# Altium schematic sheet output_stage.SchDoc: AI ARTIQ Driver
size 420 x 297 mm; Author: G.Kasprowicz; CompanyName: CTI; Organization: CTI; Address1: CTI; Address2: Nowowiejska 15/19 00-665 Warsaw; Address3: gkasprow@gmail.com; DocumentNumber: 2; Revision: 1.0; SheetNumber: 2; SheetTotal: 11; ModifiedBy: -; CheckedDate: -; Title2: output stage; DivGrp: CTI; ModifiedDate: -; ProjectName: Sensor Box
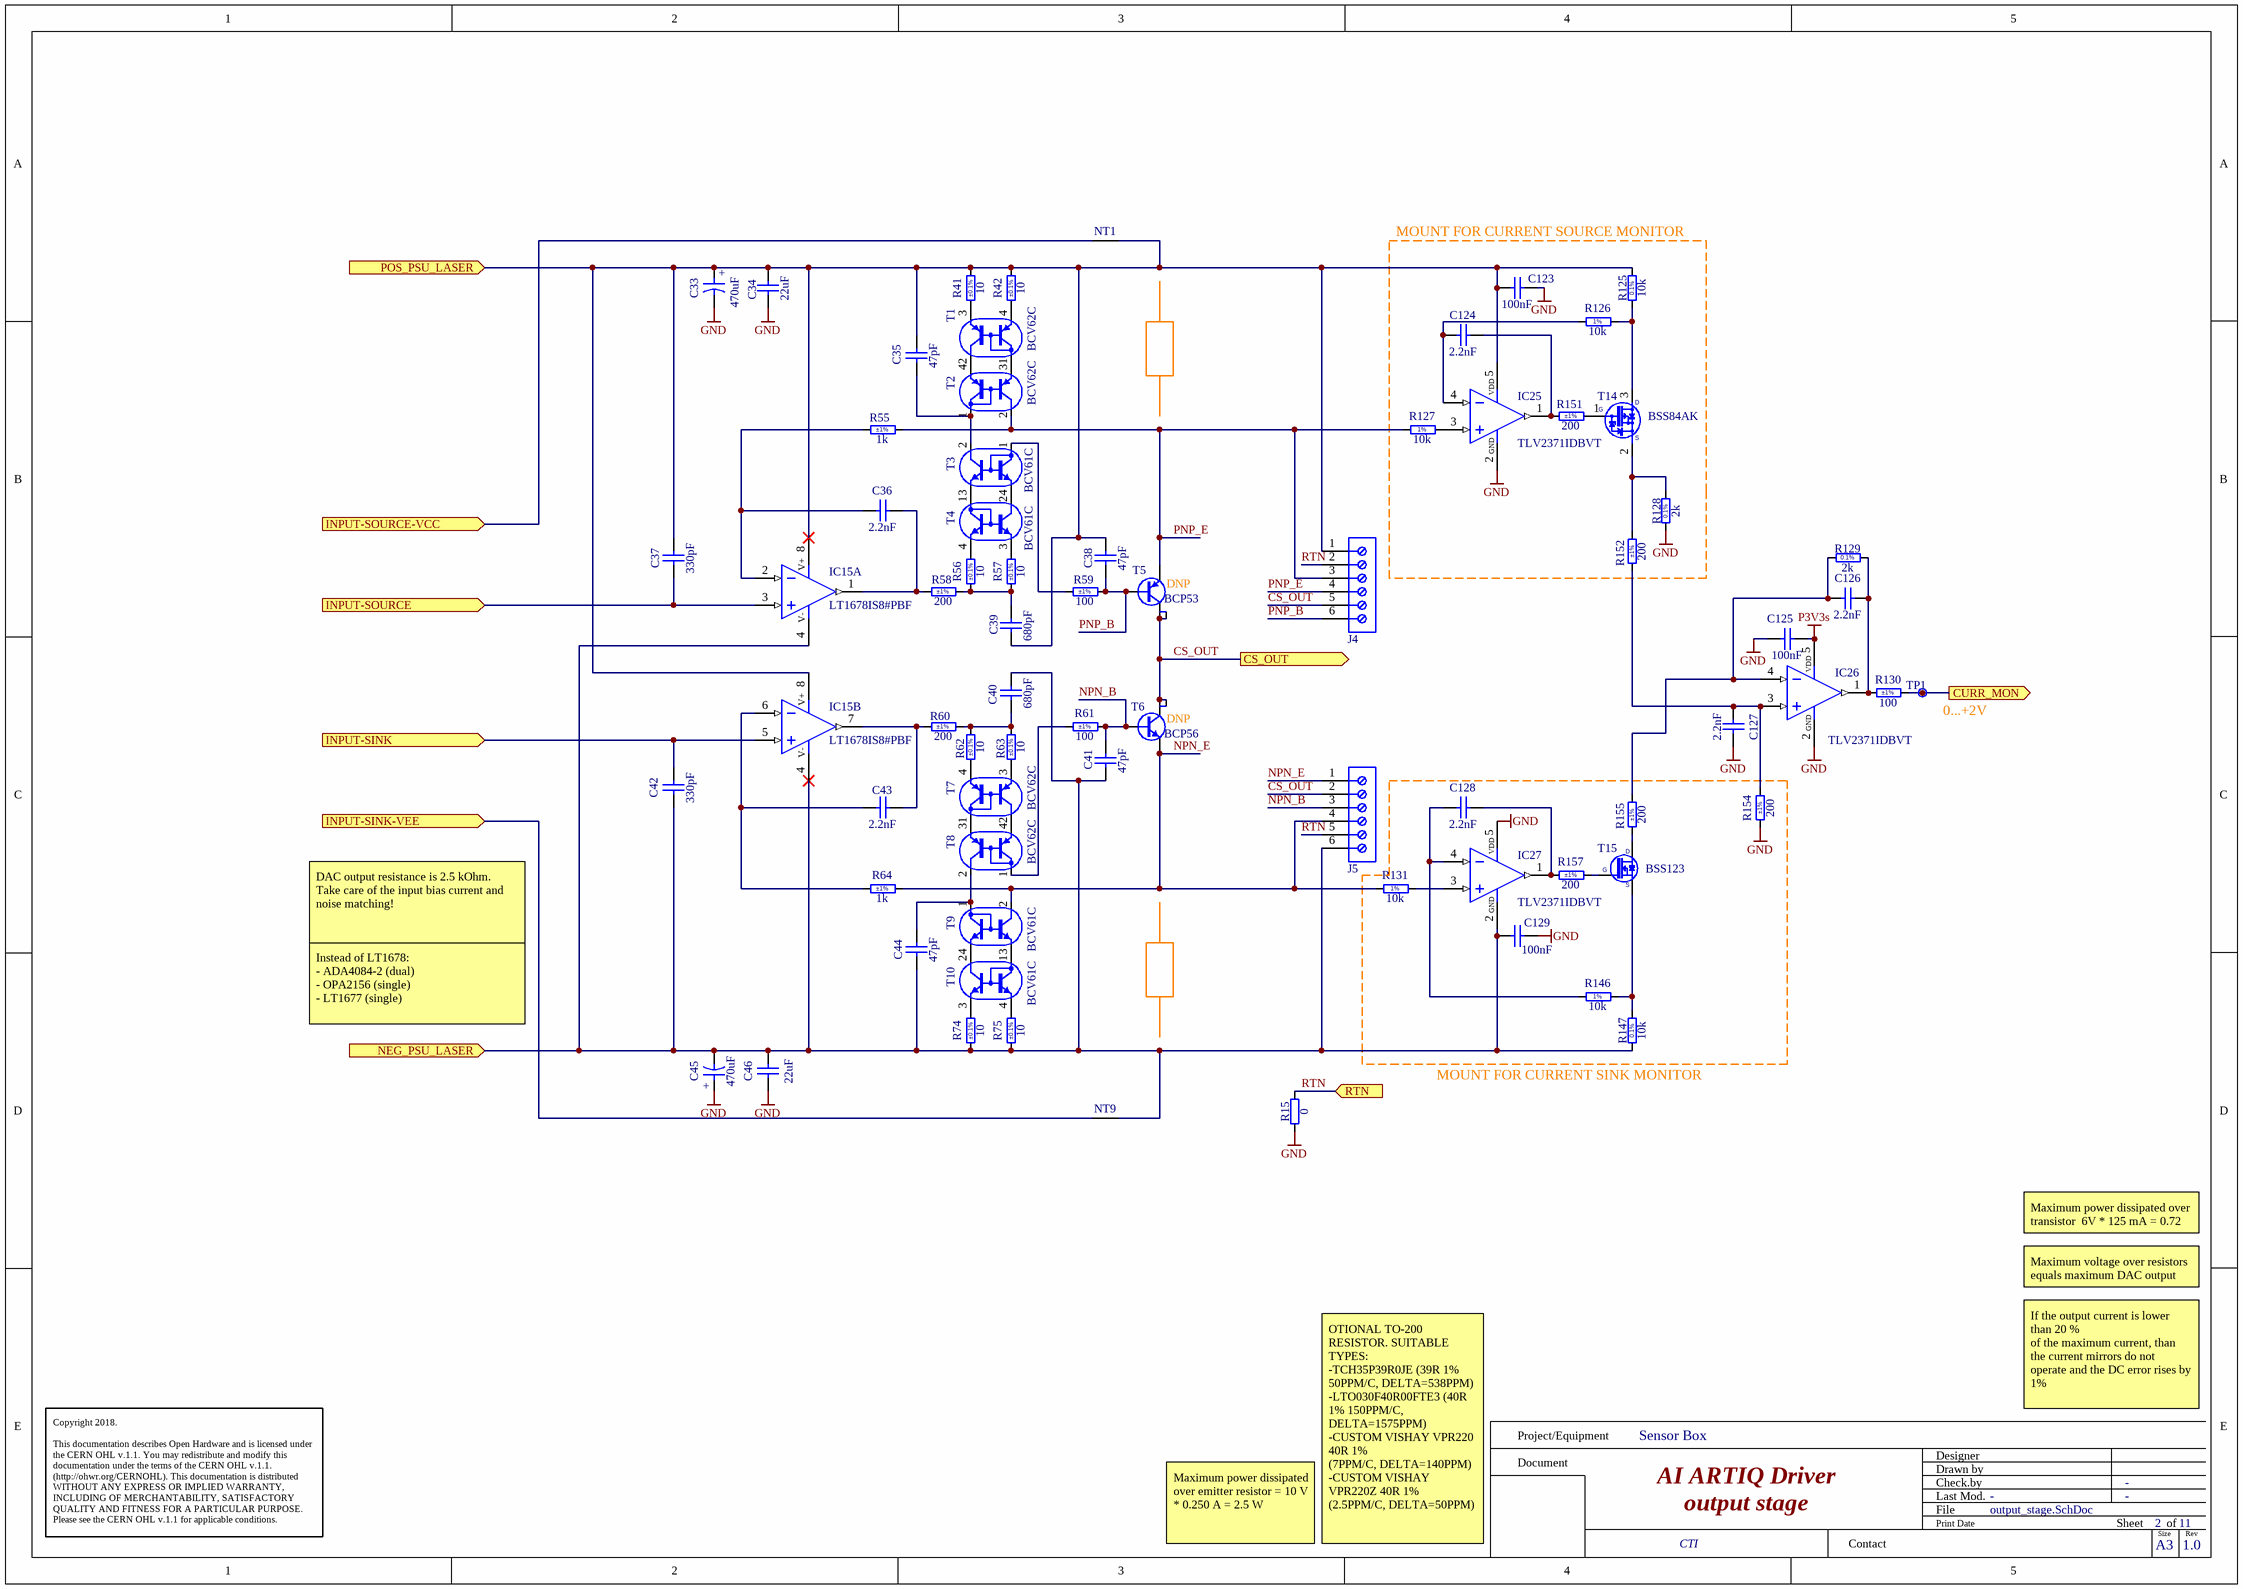
[diagram p0: output_stage.SchDoc]

## Parts
C33  470uF  [CAPAE1030X1020N]
C34  22uF  [CAPC3225X140N]
C35  47pF  [CAPC1608X87N]
C36  2.2nF  [CAPC1608X87N]
C37  330pF  [CAPC1608X90N]
C38  47pF  [CAPC1608X87N]
C39  680pF  [CAPC1608X87N]
C40  680pF  [CAPC1608X87N]
C41  47pF  [CAPC1608X87N]
C42  330pF  [CAPC1608X90N]
C43  2.2nF  [CAPC1608X87N]
C44  47pF  [CAPC1608X87N]
C45  470uF  [CAPAE1030X1020N]
C46  22uF  [CAPC3225X140N]
C123  100nF  [CAPC1608X87N]
C124  2.2nF  [CAPC1608X87N]
C125  100nF  [CAPC1608X87N]
C126  2.2nF  [CAPC1608X87N]
C127  2.2nF  [CAPC1608X87N]
C128  2.2nF  [CAPC1608X87N]
C129  100nF  [CAPC1608X87N]
IC15  LT1678IS8#PBF  [SOIC127P600X175-8N]  (parts A,B of 2)
IC25  TLV2371IDBVT  [SOT95P280X145-5N]
IC26  TLV2371IDBVT  [SOT95P280X145-5N]
IC27  TLV2371IDBVT  [SOT95P280X145-5N]
J4  691210910006  [691210910006]  (value not drawn)
J5  691210910006  [691210910006]  (value not drawn)
NT1  Net Tie  [Net Tie]  (value not drawn)  (net tie, no BOM)
NT9  Net Tie  [Net Tie]  (value not drawn)  (net tie, no BOM)
R15  0  [RESC2012X60N]
R41  10  Tolerance: ±0.1%  [RESC1608X55N]
R42  10  Tolerance: ±0.1%  [RESC1608X55N]
R55  1k  Tolerance: ±1%  [RESC1608X55N]
R56  10  Tolerance: ±0.1%  [RESC1608X55N]
R57  10  Tolerance: ±0.1%  [RESC1608X55N]
R58  200  Tolerance: ±1%  [RESC1608X55N]
R59  100  Tolerance: ±1%  [RESC1608X55N]
R60  200  Tolerance: ±1%  [RESC1608X55N]
R61  100  Tolerance: ±1%  [RESC1608X55N]
R62  10  Tolerance: ±0.1%  [RESC1608X55N]
R63  10  Tolerance: ±0.1%  [RESC1608X55N]
R64  1k  Tolerance: ±1%  [RESC1608X55N]
R74  10  Tolerance: ±0.1%  [RESC1608X55N]
R75  10  Tolerance: ±0.1%  [RESC1608X55N]
R125  10k  [RESC1608X64N]
R126  10k  [RESC1608X55N]
R127  10k  [RESC1608X55N]
R128  2k  [RESC1608X55N]
R129  2k  [RESC1608X55N]
R130  100  Tolerance: ±1%  [RESC1608X55N]
R131  10k  [RESC1608X55N]
R146  10k  [RESC1608X55N]
R147  10k  [RESC1608X64N]
R151  200  Tolerance: ±1%  [RESC1608X55N]
R152  200  Tolerance: ±1%  [RESC1608X55N]
R154  200  Tolerance: ±1%  [RESC1608X55N]
R155  200  Tolerance: ±1%  [RESC1608X55N]
R157  200  Tolerance: ±1%  [RESC1608X55N]
T1  BCV62C  [SOT143N]
T2  BCV62C  [SOT143N]
T3  BCV61C  [SOT143N]
T4  BCV61C  [SOT143N]
T5  BCP53  [SOT230P700X180-4N]
T6  BCP56  [SOT230P700X180-4N]
T7  BCV62C  [SOT143N]
T8  BCV62C  [SOT143N]
T9  BCV61C  [SOT143N]
T10  BCV61C  [SOT143N]
T14  BSS84AK  [SOT95P230X110-3N]
T15  BSS123  [SOT95P240X130-3N]
TP1  Test Point  [TPS127]  (value not drawn)  (no BOM)

## Blocks framed on the sheet
MOUNT FOR CURRENT SOURCE MONITOR: C123 C124 IC25 R125-R128 R151 R152 T14

## Ports
CS_OUT (out), CURR_MON (out), INPUT-SINK (in), INPUT-SINK-VEE (in), INPUT-SOURCE (in), INPUT-SOURCE-VCC (in), NEG_PSU_LASER (in), POS_PSU_LASER (in), RTN (in)

## Nets
GND: C33.2 C34.1 C45.1 C46.2 C123.2 C125.1 C127.2 C129.1 IC25.2(V-) IC26.2(V-) IC27.5(V+) R15.1 R128.1 R154.1
P3V3s: C125.2 IC26.5(V+)
CS_OUT: J4.5 J5.2 T5.2(C) T5.4(C) T6.2(C) T6.4(C) ; port CS_OUT
CURR_MON: R130.2 TP1.1 ; port CURR_MON
INPUT-SINK: C42.2 IC15.5(IN+) ; port INPUT-SINK
INPUT-SINK-VEE: NT9.1 ; port INPUT-SINK-VEE
INPUT-SOURCE: C37.1 IC15.3(IN+) ; port INPUT-SOURCE
INPUT-SOURCE-VCC: NT1.1 ; port INPUT-SOURCE-VCC
NEG_PSU_LASER: C40.2 C41.1 C42.1 C44.1 C45.2 C46.1 C129.2 IC15.4(V-) IC27.2(V-) J5.6 NT9.2 R74.1 R75.1 R147.1 ; port NEG_PSU_LASER
NPN_B: C41.2 J5.3 R61.2 T6.1(B)
NPN_E: J5.1 J5.4 R64.2 R131.1 T6.3(E) T9.2(C)
PNP_B: C38.1 J4.6 R59.2 T5.1(B)
PNP_E: J4.3 J4.4 R55.2 R127.1 T2.2(C) T5.3(E)
POS_PSU_LASER: C33.1 C34.2 C35.2 C37.2 C38.2 C39.1 C123.1 IC15.8(V+) IC25.5(V+) J4.1 NT1.2 R41.2 R42.2 R125.2 ; port POS_PSU_LASER
RTN: J4.2 J5.5 R15.2 ; port RTN
NetC35_1: C35.1 T2.1(C) T3.2(C)
NetC36_1: C36.1 IC15.2(IN-) R55.1
NetC36_2: C36.2 IC15.1(OUT) R58.1
NetC39_2: C39.2 R56.1 R57.1 R58.2
NetC40_1: C40.1 R60.2 R62.2 R63.2
NetC43_1: C43.1 IC15.6(IN-) R64.1
NetC43_2: C43.2 IC15.7(OUT) R60.1
NetC44_2: C44.2 T8.2(C) T9.1(C)
NetC124_1: C124.1 IC25.4(IN-) R126.1
NetC124_2: C124.2 IC25.1(OUT) R151.1
NetC126_1: C126.1 IC26.4(IN-) R129.1 R155.2
NetC126_2: C126.2 IC26.1(OUT) R129.2 R130.1
NetC127_1: C127.1 IC26.3(IN+) R152.1 R154.2
NetC128_1: C128.1 IC27.4(IN-) R146.1
NetC128_2: C128.2 IC27.1(OUT) R157.1
NetIC25_3: IC25.3(IN+) R127.2
NetIC27_3: IC27.3(IN+) R131.2
NetR41_1: R41.1 T1.3(E)
NetR42_1: R42.1 T1.4(E)
NetR56_2: R56.2 T4.4(E)
NetR57_2: R57.2 T4.3(E)
NetR59_1: R59.1 T3.1(C)
NetR61_1: R61.1 T8.1(C)
NetR62_1: R62.1 T7.4(E)
NetR63_1: R63.1 T7.3(E)
NetR74_2: R74.2 T10.3(E)
NetR75_2: R75.2 T10.4(E)
NetR125_1: R125.1 R126.2 T14.3(D)
NetR128_2: R128.2 R152.2 T14.2(S)
NetR146_2: R146.2 R147.2 T15.2(S)
NetR151_2: R151.2 T14.1(G)
NetR155_1: R155.1 T15.3(D)
NetR157_2: R157.2 T15.1(G)
NetT1_1: T1.1(C) T2.3(E)
NetT1_2: T1.2(C) T2.4(E)
NetT3_3: T3.3(E) T4.1(C)
NetT3_4: T3.4(E) T4.2(C)
NetT7_1: T7.1(C) T8.3(E)
NetT7_2: T7.2(C) T8.4(E)
NetT9_3: T9.3(E) T10.1(C)
NetT9_4: T9.4(E) T10.2(C)

## Notes on the sheet
- (near T5) DNP
- (near T6) DNP
- (near TP1) 0...+2V
- DAC output resistance is 2.5 kOhm.
  Take care of the input bias current and noise matching!
- Instead of LT1678:
  - ADA4084-2 (dual)
  - OPA2156 (single)
  - LT1677 (single)
- (near R147) MOUNT FOR CURRENT SINK MONITOR
- Maximum power dissipated over transistor  6V * 125 mA = 0.72 W
- Maximum voltage over resistors equals maximum DAC output voltage = 10 V
- If the output current is lower than 20 %
  of the maximum current, than the current mirrors do not operate and the DC error rises by  1%
- Maximum power dissipated over emitter resistor = 10 V * 0.250 A = 2.5 W
- OTIONAL TO-200 RESISTOR. SUITABLE TYPES:
  -TCH35P39R0JE (39R 1% 50PPM/C, DELTA=538PPM)
  -LTO030F40R00FTE3 (40R 1% 150PPM/C, DELTA=1575PPM)
  -CUSTOM VISHAY VPR220 40R 1%
  (7PPM/C, DELTA=140PPM)
  -CUSTOM VISHAY VPR220Z 40R 1%
  (2.5PPM/C, DELTA=50PPM)
- Project/Equipment
- Document
- Designer
- Drawn by
- Check.by
- Copyright 2018.
  This documentation describes Open Hardware and is licensed under the CERN OHL v.1.1. You may redistribute and modify this documentation under the terms of the CERN OHL v.1.1. (http://ohwr.org/CERNOHL). This documentation is distributed WITHOUT ANY EXPRESS OR IMPLIED WARRANTY, INCLUDING OF MERCHANTABILITY, SATISFACTORY QUALITY AND FITNESS FOR A PARTICULAR PURPOSE. Please see the CERN OHL v.1.1 for applicable conditions.
- Contact
- File
- Last Mod.
- Print Date
- Sheet
- Size
- A3
- of
- Rev
- (in symbol CAE1030-1020_470UF_25V_20%) +
- (in symbol R0603_2K_0.1%_0.063W_10PPM) 0.1%
- (in symbol R0603_10K_0.1%_0.1W_25PPM) 0.1%
- (in symbol R0603_10K_1%_0.1W_100PPM) 1%
- (in symbol TLV2371IDBVT) VDD; GND

## Library data of the parts
C33 C45 = CAE1030-1020_470UF_25V_20%: Polarised capacitor; Part Description: Aluminum Electrolytic SMT Capacitor; Manufacturer: PANASONIC; Manufacturer Part Number: EEEFK1E471AP; Voltage: 25V; Tolerance: ±20%; Part Number: CAE1030-1020_470UF_25V_20%; Component Kind: Standard; Component Type: Standard; Pin Count: 2; Value: 470uF; Status: Not Recommended; Case: G; Mounted: Yes; Socket: No; SMD: Yes; Sense: No; ComponentHeight: 10.2mm; HelpURL: \\cern.ch\dfs\Applications\Altium\Datasheets\CAE_PANASONIC_FK-V.pdf; Author: CERN DEM JLC; CreateDate: 03.12.2007; LatestRevisionDate: 05.11.2014
C34 C46 = CC1210_22UF_25V_20%_X7R: Non-polarised capacitor; Part Description: SMD Multilayer Chip Ceramic Capacitor; Manufacturer: GENERIC; Manufacturer1 Part Number: C1210C226M3RACTU; Voltage: 25V; TC: X7R; Tolerance: ±20%; Part Number: CC1210_22UF_25V_20%_X7R; Component Kind: Standard; Component Type: Standard; Pin Count: 2; Value: 22uF; Status: None; Manufacturer Part Number: CC1210_22UF_25V_20%_X7R; Case: 1210; Mounted: Yes; Socket: No; SMD: Yes; Sense: No; Manufacturer1 Example: KEMET; Manufacturer1 ComponentHeight: 1.4mm; HelpURL: \\cern.ch\dfs\Applications\Altium\Datasheets\CC1210_X7R_KEMET.pdf; Author: CERN DEM JLC; CreateDate: 20.02.2018; LatestRevisionDate: 20.02.2018
C35 C38 C41 C44 = CC0603_47PF_50V_5%_NP0: Non-polarised capacitor; Part Description: SMD Multilayer Chip Ceramic Capacitor; Manufacturer: GENERIC; Manufacturer1 Part Number: 223886715479; Voltage: 50V; TC: C0G/NP0; Tolerance: ±5%; Part Number: CC0603_47PF_50V_5%_NP0; Component Kind: Standard; Component Type: Standard; Pin Count: 2; Value: 47pF; Status: Preferred; Manufacturer Part Number: CC0603_47PF_50V_5%_NP0; Case: 0603; Mounted: Yes; Socket: No; SMD: Yes; Sense: No; Manufacturer1 Example: PHYCOMP; Manufacturer1 ComponentHeight: 0.87mm; HelpURL: \\cern.ch\dfs\Applications\Altium\Datasheets\CC0603_NP0_PHYCOMP.pdf; Author: CERN DEM JLC; CreateDate: 03.12.2007; LatestRevisionDate: 03.12.2007
C36 C43 C124 C126-C128 = CC0603_2.2NF_50V_5%_C0G: Non-polarised capacitor; Part Description: SMD Multilayer Chip Ceramic Capacitor; Manufacturer: GENERIC; Manufacturer1 Part Number: C1608C0G1H222J080AA; Voltage: 50V; TC: C0G/NP0; Tolerance: ±5%; Part Number: CC0603_2.2NF_50V_5%_C0G; Component Kind: Standard; Component Type: Standard; Pin Count: 2; Value: 2.2nF; Status: Preferred; Manufacturer Part Number: CC0603_2.2NF_50V_5%_C0G; Case: 0603; Mounted: Yes; Socket: No; SMD: Yes; Sense: No; Manufacturer1 Example: TDK; Manufacturer1 ComponentHeight: 0.9mm; HelpURL: \\cern.ch\dfs\Applications\Altium\Datasheets\CC0603_C0G_TDK_C.pdf; Author: CERN DEM JMW; CreateDate: 23.06.2014; LatestRevisionDate: 23.06.2014
C37 C42 = CC0603_330PF_50V_5%_C0G_MURATA_GCM1885C1H331JA16D: Non-polarised capacitor; Part Description: Chip Monolithic Ceramic Capacitor for Automotive; Manufacturer: MURATA; Voltage: 50V; TC: C0G/NP0; Tolerance: ±5%; Part Number: CC0603_330PF_50V_5%_C0G_MURATA_GCM1885C1H331JA16D; Component Kind: Standard; Component Type: Standard; Pin Count: 2; Value: 330pF; Status: Not Recommended; Manufacturer Part Number: GCM1885C1H331JA16D; Case: 0603; Mounted: Yes; Socket: No; SMD: Yes; Sense: No; ComponentHeight: 0.9mm; HelpURL: \\cern.ch\dfs\Applications\Altium\Datasheets\CC0603_MURATA_GCM1885C1H331JA16D.pdf; Author: CERN DEM JLC; CreateDate: 10.05.2017; LatestRevisionDate: 10.05.2017
C39 C40 = CC0603_680PF_50V_5%_NP0: Non-polarised capacitor; Part Description: SMD Multilayer Chip Ceramic Capacitor; Manufacturer: GENERIC; Manufacturer1 Part Number: 223886715681; Voltage: 50V; TC: C0G/NP0; Tolerance: ±5%; Part Number: CC0603_680PF_50V_5%_NP0; Component Kind: Standard; Component Type: Standard; Pin Count: 2; Value: 680pF; Status: Preferred; Manufacturer Part Number: CC0603_680PF_50V_5%_NP0; Case: 0603; Mounted: Yes; Socket: No; SMD: Yes; Sense: No; Manufacturer1 Example: PHYCOMP; Manufacturer1 ComponentHeight: 0.87mm; HelpURL: \\cern.ch\dfs\Applications\Altium\Datasheets\CC0603_NP0_PHYCOMP.pdf; Author: CERN DEM JLC; CreateDate: 03.12.2007; LatestRevisionDate: 03.12.2007
C123 C125 C129 = CC0603_100NF_50V_10%_X7R: Non-polarised capacitor; Part Description: SMD Multilayer Chip Ceramic Capacitor; Manufacturer: GENERIC; Manufacturer1 Part Number: 223858615649; Voltage: 50V; TC: X7R; Tolerance: ±10%; Part Number: CC0603_100NF_50V_10%_X7R; Component Kind: Standard; Component Type: Standard; Pin Count: 2; Value: 100nF; Status: Preferred; Manufacturer Part Number: CC0603_100NF_50V_10%_X7R; Case: 0603; Mounted: Yes; Socket: No; SMD: Yes; Sense: No; Manufacturer1 Example: PHYCOMP; Manufacturer1 ComponentHeight: 0.87mm; HelpURL: \\cern.ch\dfs\Applications\Altium\Datasheets\CC0603_X7R_PHYCOMP.pdf; Author: CERN DEM JLC; CreateDate: 03.12.2007; LatestRevisionDate: 03.12.2007
IC15 = LT1678IS8#PBF: Dual Operational Amplifier; Part Description: Dual Low Noise, Rail-to-Rail, Precision Operational Amplifier; Manufacturer: LINEAR TECHNOLOGY; PressFit: No; Bonding: No; Part Number: LT1678IS8#PBF; Component Kind: Standard; Component Type: Standard; Device: LT1678IS8#PBF; PackageDescription: SOIC 8, Pitch 1.27mm - Body 4x5mm, IPC Medium Density; Manufacturer Part Number: LT1678IS8#PBF; Pin Count: 8; Case: SOIC8; Mounted: Yes; Socket: No; SMD: Yes; Sense: No; ComponentHeight: 1.75mm; Author: CERN DEM JLC; HelpURL: \\cern.ch\dfs\Applications\Altium\Datasheets\LT1678IS8#PBF.pdf; CreateDate: 09.07.2014; LatestRevisionDate: 09.07.2014
IC25-IC27 = TLV2371IDBVT: 500uA, 3MHz Rail-to-Rail Input/Output Operational Amplifier With Shutdown; Manufacturer: TEXAS INSTRUMENTS; PressFit: No; Bonding: No; Part Number: TLV2371IDBVT; Component Kind: Standard; Component Type: Standard; Device: TLV2371IDBVT; PackageDescription: SOT, 0.95mm pitch; 5 Pin, 1.60mm W X 2.90mm L X 1.45mm H body, IPC Medium Density; Part Description: 500uA, 3MHz Rail-to-Rail Input/Output Operational Amplifier With Shutdown; Manufacturer Part Number: TLV2371IDBVT; Pin Count: 5; Case: SOT23-5; Mounted: Yes; Socket: No; SMD: Yes; Sense: No; ComponentHeight: 1.45mm; Author: CERN DEM JLC; HelpURL: \\cern.ch\dfs\Applications\Altium\Datasheets\TLV2371IDBVT.pdf; CreateDate: 03.07.2014; LatestRevisionDate: 03.07.2014
J4 J5 = 691210910006: WR-TBL Series 2109 Horizontal Entry, Through Hole, pitch 2.54mm, 6p; Manufacturer: Wurth Elektronik; Pin Number: 6; Rated Current: 6A; Working Voltage: 150V; PCB/Cable/Panel: PCB; Modularity: No; ComponentLink1Description: Manufacturer Link; ComponentLink1URL: https://www.we-online.com/redexpert/article/691210910006?ad; ComponentLink2Description: Datasheet; ComponentLink2URL: https://www.we-online.com/redexpert/spec/691210910006?ad; Category: Terminal Blocks; Match Code: WR-TBL; Manufacturer Part Number: 691210910006; Mount: Through Hole; Operating Temperature Max: 105°C; Operating Temperature Min: -40°C; Packaging: Box; Pitch: 2.54mm; Orientation: Horizontal; Application: Rising Cage Clamp
NT1 NT9 = Net Tie: Part Description: Net Tie (2 Nets); Mounted: No; Part Number: Net Tie; Component Type: Net Tie; Pin Count: 2; Family: Net Tie; Socket: No; SMD: No; Sense: No; Status: None; ComponentHeight: 0mm; HelpURL: Undefined; Author: CERN DEM JLC; CreateDate: 22.03.2011; LatestRevisionDate: 22.03.2011; PackageDescription: 2 Plated Through Hole For Coaxial Cable Link: Hole Dia.=1.4mm Pad Dia.=2.5mm
R15 = R0805_0R_JUMPER: Resistor; Part Description: 2A (0.05R Max DC Resistance) Zero Ohm Jumper; Manufacturer: GENERIC; Manufacturer1 Part Number: NRC10Z0; PressFit: No; Part Number: R0805_0R_JUMPER; Component Kind: Standard; Component Type: Standard; Pin Count: 2; Value: 0; Status: Preferred; Manufacturer Part Number: R0805_0R_JUMPER; Case: 0805; Mounted: Yes; Sense: No; Socket: No; SMD: Yes; Manufacturer1 Example: NIC COMPONENT; Manufacturer1 ComponentHeight: 0.6mm; HelpURL: \\cern.ch\dfs\Applications\Altium\Datasheets\R0805_NIC_NRC.pdf; Author: CERN DEM JLC; CreateDate: 03.12.2007; LatestRevisionDate: 13.03.2008
R41 R42 R56 R57 R62 R63 R74 R75 = R0603_10R_0.1%_0.063W_25PPM: Resistor - 0.1%; Part Description: Thin Film Chip Resistor; Manufacturer: GENERIC; Manufacturer1 Part Number: CPF0603B10RE1; Power: 0.063W; TC: ±25ppm; PressFit: No; Part Number: R0603_10R_0.1%_0.063W_25PPM; Component Kind: Standard; Component Type: Standard; Pin Count: 2; Value: 10; Status: Not Recommended; Manufacturer Part Number: R0603_10R_0.1%_0.063W_25PPM; Case: 0603; Mounted: Yes; Sense: No; Socket: No; SMD: Yes; Manufacturer1 Example: TE CONNECTIVITY; Manufacturer1 ComponentHeight: 0.55mm; HelpURL: \\cern.ch\dfs\Applications\Altium\Datasheets\R0603_TYCO_CPF.pdf; Author: CERN DEM JLC; CreateDate: 12.01.2017; LatestRevisionDate: 12.01.2017
R55 R64 = R0603_1K_1%_0.1W_100PPM: Resistor - 1%; Part Description: General Purpose Thick Film Chip Resistor; Manufacturer: GENERIC; Manufacturer1 Part Number: NRC06F1001TRF; Power: 0.1W; TC: ±100ppm/°C; PressFit: No; Part Number: R0603_1K_1%_0.1W_100PPM; Component Kind: Standard; Component Type: Standard; Pin Count: 2; Value: 1k; Status: Preferred; Manufacturer Part Number: R0603_1K_1%_0.1W_100PPM; Case: 0603; Mounted: Yes; Sense: No; Socket: No; SMD: Yes; Manufacturer1 Example: NIC COMPONENT; Manufacturer1 ComponentHeight: 0.55mm; HelpURL: \\cern.ch\dfs\Applications\Altium\Datasheets\R0603_NIC_NRC.pdf; Author: CERN DEM JLC; CreateDate: 03.12.2007; LatestRevisionDate: 13.03.2008
R58 R60 R151 R152 R154 R155 R157 = R0603_200R_1%_0.1W_100PPM: Resistor - 1%; Part Description: General Purpose Thick Film Chip Resistor; Manufacturer: GENERIC; Manufacturer1 Part Number: NRC06F2000TRF; Power: 0.1W; TC: ±100ppm/°C; PressFit: No; Part Number: R0603_200R_1%_0.1W_100PPM; Component Kind: Standard; Component Type: Standard; Pin Count: 2; Value: 200; Status: Preferred; Manufacturer Part Number: R0603_200R_1%_0.1W_100PPM; Case: 0603; Mounted: Yes; Sense: No; Socket: No; SMD: Yes; Manufacturer1 Example: NIC COMPONENT; Manufacturer1 ComponentHeight: 0.55mm; HelpURL: \\cern.ch\dfs\Applications\Altium\Datasheets\R0603_NIC_NRC.pdf; Author: CERN DEM JLC; CreateDate: 03.12.2007; LatestRevisionDate: 13.03.2008
R59 R61 R130 = R0603_100R_1%_0.1W_100PPM: Resistor - 1%; Part Description: General Purpose Thick Film Chip Resistor; Manufacturer: GENERIC; Manufacturer1 Part Number: NRC06F4700TRF; Power: 0.1W; TC: ±100ppm/°C; PressFit: No; Part Number: R0603_100R_1%_0.1W_100PPM; Component Kind: Standard; Component Type: Standard; Pin Count: 2; Value: 100; Status: Preferred; Manufacturer Part Number: R0603_100R_1%_0.1W_100PPM; Case: 0603; Mounted: Yes; Sense: No; Socket: No; SMD: Yes; Manufacturer1 Example: NIC COMPONENT; Manufacturer1 ComponentHeight: 0.55mm; HelpURL: \\cern.ch\dfs\Applications\Altium\Datasheets\R0603_NIC_NRC.pdf; Author: CERN DEM JLC; CreateDate: 03.12.2007; LatestRevisionDate: 13.03.2008
R125 R147 = R0603_10K_0.1%_0.1W_25PPM: Resistor - 0.1%; Part Description: Thin Film Chip Resistor; Manufacturer: GENERIC; Manufacturer1 Part Number: ERA3AEB103V; Power: 0.1W; TC: ±25ppm/°C; PressFit: No; Part Number: R0603_10K_0.1%_0.1W_25PPM; Component Kind: Standard; Component Type: Standard; Pin Count: 2; Value: 10k; Status: Not Recommended; Tolerance: ±0.1%; Manufacturer Part Number: R0603_10K_0.1%_0.1W_25PPM; Case: 0603; Mounted: Yes; Sense: No; Socket: No; SMD: Yes; Manufacturer1 Example: PANASONIC; Manufacturer1 ComponentHeight: 0.55mm; HelpURL: \\cern.ch\dfs\Applications\Altium\Datasheets\R0603_PANASONIC_ERA.pdf; Author: CERN DEM JMW; CreateDate: 09.11.2015; LatestRevisionDate: 11.01.2017
R126 R127 R131 R146 = R0603_10K_1%_0.1W_100PPM: Resistor - 1%; Part Description: General Purpose Thick Film Chip Resistor; Manufacturer: GENERIC; Manufacturer1 Part Number: NRC06F1002TRF; Power: 0.1W; TC: ±100ppm/°C; PressFit: No; Part Number: R0603_10K_1%_0.1W_100PPM; Component Kind: Standard; Component Type: Standard; Pin Count: 2; Value: 10k; Status: Preferred; Tolerance: ±1%; Manufacturer Part Number: R0603_10K_1%_0.1W_100PPM; Case: 0603; Mounted: Yes; Sense: No; Socket: No; SMD: Yes; Manufacturer1 Example: NIC COMPONENT; Manufacturer1 ComponentHeight: 0.55mm; HelpURL: \\cern.ch\dfs\Applications\Altium\Datasheets\R0603_NIC_NRC.pdf; Author: CERN DEM JLC; CreateDate: 03.12.2007; LatestRevisionDate: 13.03.2008
R128 R129 = R0603_2K_0.1%_0.063W_10PPM: Resistor - 0.1%; Part Description: Thin Film Chip Resistor; Manufacturer: GENERIC; Manufacturer1 Part Number: RN73C1J2K0BTDF; Power: 0.063W; TC: ±10ppm; PressFit: No; Part Number: R0603_2K_0.1%_0.063W_10PPM; Component Kind: Standard; Component Type: Standard; Pin Count: 2; Value: 2k; Status: Not Recommended; Tolerance: ±0.1%; Manufacturer Part Number: R0603_2K_0.1%_0.063W_10PPM; Case: 0603; Mounted: Yes; Sense: No; Socket: No; SMD: Yes; Manufacturer1 Example: TYCO HOLSWORTHY; Manufacturer1 ComponentHeight: 0.5mm; HelpURL: \\cern.ch\dfs\Applications\Altium\Datasheets\R0603_Tyco_RN73.pdf; Author: CERN DEM JLC; CreateDate: 03.12.2007; LatestRevisionDate: 13.03.2008
T1 T2 T7 T8 = BCV62C: Double PNP Transistor; Part Description: 30V 100mA PNP General Purpose Double Transistor; Manufacturer: NXP SEMICONDUCTORS; PressFit: No; Bonding: No; Part Number: BCV62C; Component Kind: Standard; Component Type: Standard; Device: BCV62C; PackageDescription: SOT143, 4-Leads, Body 3.0x2.6mm (max), Pitch 1.92mm, IPC Medium Density; Manufacturer Part Number: BCV62C; Pin Count: 4; Case: SOT143; Mounted: Yes; Socket: No; SMD: Yes; Sense: No; ComponentHeight: 1.3mm; HelpURL: \\cern.ch\dfs\Applications\Altium\Datasheets\BCV62C.pdf; Author: CERN DEM JLC; CreateDate: 20.08.2008; LatestRevisionDate: 20.08.2008
T3 T4 T9 T10 = BCV61C: Double NPN Transistor; Part Description: 30V 100mA NPN General Purpose Double Transistor; Manufacturer: NXP SEMICONDUCTORS; PressFit: No; Bonding: No; Part Number: BCV61C; Component Kind: Standard; Component Type: Standard; Device: BCV61C; PackageDescription: SOT143, 4-Leads, Body 3.0x2.6mm (max), Pitch 1.92mm, IPC Medium Density; Manufacturer Part Number: BCV61C; Pin Count: 4; Case: SOT143; Mounted: Yes; Socket: No; SMD: Yes; Sense: No; ComponentHeight: 1.3mm; HelpURL: \\cern.ch\dfs\Applications\Altium\Datasheets\BCV61C.pdf; Author: CERN DEM JLC; CreateDate: 23.09.2014; LatestRevisionDate: 23.09.2014
T5 = BCP53: PNP Transistor; Part Description: 80V 1A PNP Medium Power Transistor; Manufacturer: NXP SEMICONDUCTORS; PressFit: No; Bonding: No; Part Number: BCP53; Component Kind: Standard; Component Type: Standard; Device: BCP53; PackageDescription: SOT223, 2.30mm Pitch; 4 Pin, 3.70mm W X 6.70mm L X 1.80mm H body, IPC Medium Density; Manufacturer Part Number: BCP53; Pin Count: 4; Case: SOT223; Mounted: Yes; Socket: No; SMD: Yes; Sense: No; ComponentHeight: 1.8mm; HelpURL: \\cern.ch\dfs\Applications\Altium\Datasheets\BCP53.pdf; Author: CERN DEM JLC; CreateDate: 25.06.2008; LatestRevisionDate: 25.06.2008
T6 = BCP56: NPN Transistor; Part Description: 80V 1A NPN Medium Power Transistor; Manufacturer: NXP SEMICONDUCTORS; PressFit: No; Bonding: No; Part Number: BCP56; Component Kind: Standard; Component Type: Standard; Device: BCP56; PackageDescription: SOT223, 2.30mm Pitch; 4 Pin, 3.70mm W X 6.70mm L X 1.80mm H body, IPC Medium Density; Manufacturer Part Number: BCP56; Pin Count: 4; Case: SOT223; Mounted: Yes; Socket: No; SMD: Yes; Sense: No; ComponentHeight: 1.8mm; HelpURL: \\cern.ch\dfs\Applications\Altium\Datasheets\BCP56.pdf; Author: CERN DEM JLC; CreateDate: 25.06.2008; LatestRevisionDate: 25.06.2008
T14 = BSS84AK: 50V, 180mA P-Channel Trench MOSFET; Part Description: 50V, 180mA P-channel Trench MOSFET Transistor; Manufacturer: NXP SEMICONDUCTORS; PressFit: No; Bonding: No; Part Number: BSS84AK; Component Kind: Standard; Component Type: Standard; Device: BSS84AK; PackageDescription: SOT23, 0.95mm Pitch; 3 Pin, 1.30mm W X 2.90mm L X 1.10mm H body, IPC Medium Density; Manufacturer Part Number: BSS84AK; Pin Count: 3; Case: SOT23-3; Mounted: Yes; Socket: No; SMD: Yes; Sense: No; ComponentHeight: 1.1mm; HelpURL: \\cern.ch\dfs\Applications\Altium\Datasheets\BSS84AK.pdf; Author: CERN DEM JLC; CreateDate: 16.04.2015; LatestRevisionDate: 16.04.2015
T15 = BSS123: N-CHANNEL MOSFET WITH DIODE; Part Description: 100V 170mA N-Channel Logic Level Enhancement Mode Field Effect Transistor (FET); Manufacturer: FAIRCHILD SEMICONDUCTOR; PressFit: No; Bonding: No; Part Number: BSS123; Component Kind: Standard; Component Type: Standard; Device: BSS123; PackageDescription: SOT23, 0.95mm Pitch; 3 Pin, 1.30mm W X 2.90mm L X 1.30mm H body, IPC Medium Density; Manufacturer Part Number: BSS123; Pin Count: 3; Case: SOT23-3; Mounted: Yes; Socket: No; SMD: Yes; Sense: No; ComponentHeight: 1.3mm; HelpURL: \\cern.ch\dfs\Applications\Altium\Datasheets\BSS123.pdf; Author: CERN DEM JLC; CreateDate: 07.04.2009; LatestRevisionDate: 07.04.2009
TP1 = SMD_PAD_1.27X1.27MM: Part Description: 1.27mm x 1.27mm PCB Copper Area (SMD Test Point); Mounted: No; Part Number: SMD_PAD_1.27X1.27MM; Component Type: Standard (No BOM); Pin Count: 1; Family: Test Point; Socket: No; SMD: No; Sense: No; Status: None; ComponentHeight: 0mm; HelpURL: Undefined; Author: CERN DEM JLC; CreateDate: 12.01.2008; LatestRevisionDate: 12.01.2008; PackageDescription: 1.27mm x 1.27mm PCB Copper Area (SMD Test Point)